# Altium schematic sheet I2C_Step_12V_Ann.SchDoc: Драйвер двигателя
size 594 x 420 mm; ApprovedBy: Рогов; CheckedBy: Капустин; DrawnBy: Нечаева; DocumentNumber: I2C_Step_12V Э3; SheetTotal: 1; Format: A2; DocumentType: Электрическая принципиальная; ImagePath: I2C_Step_12V
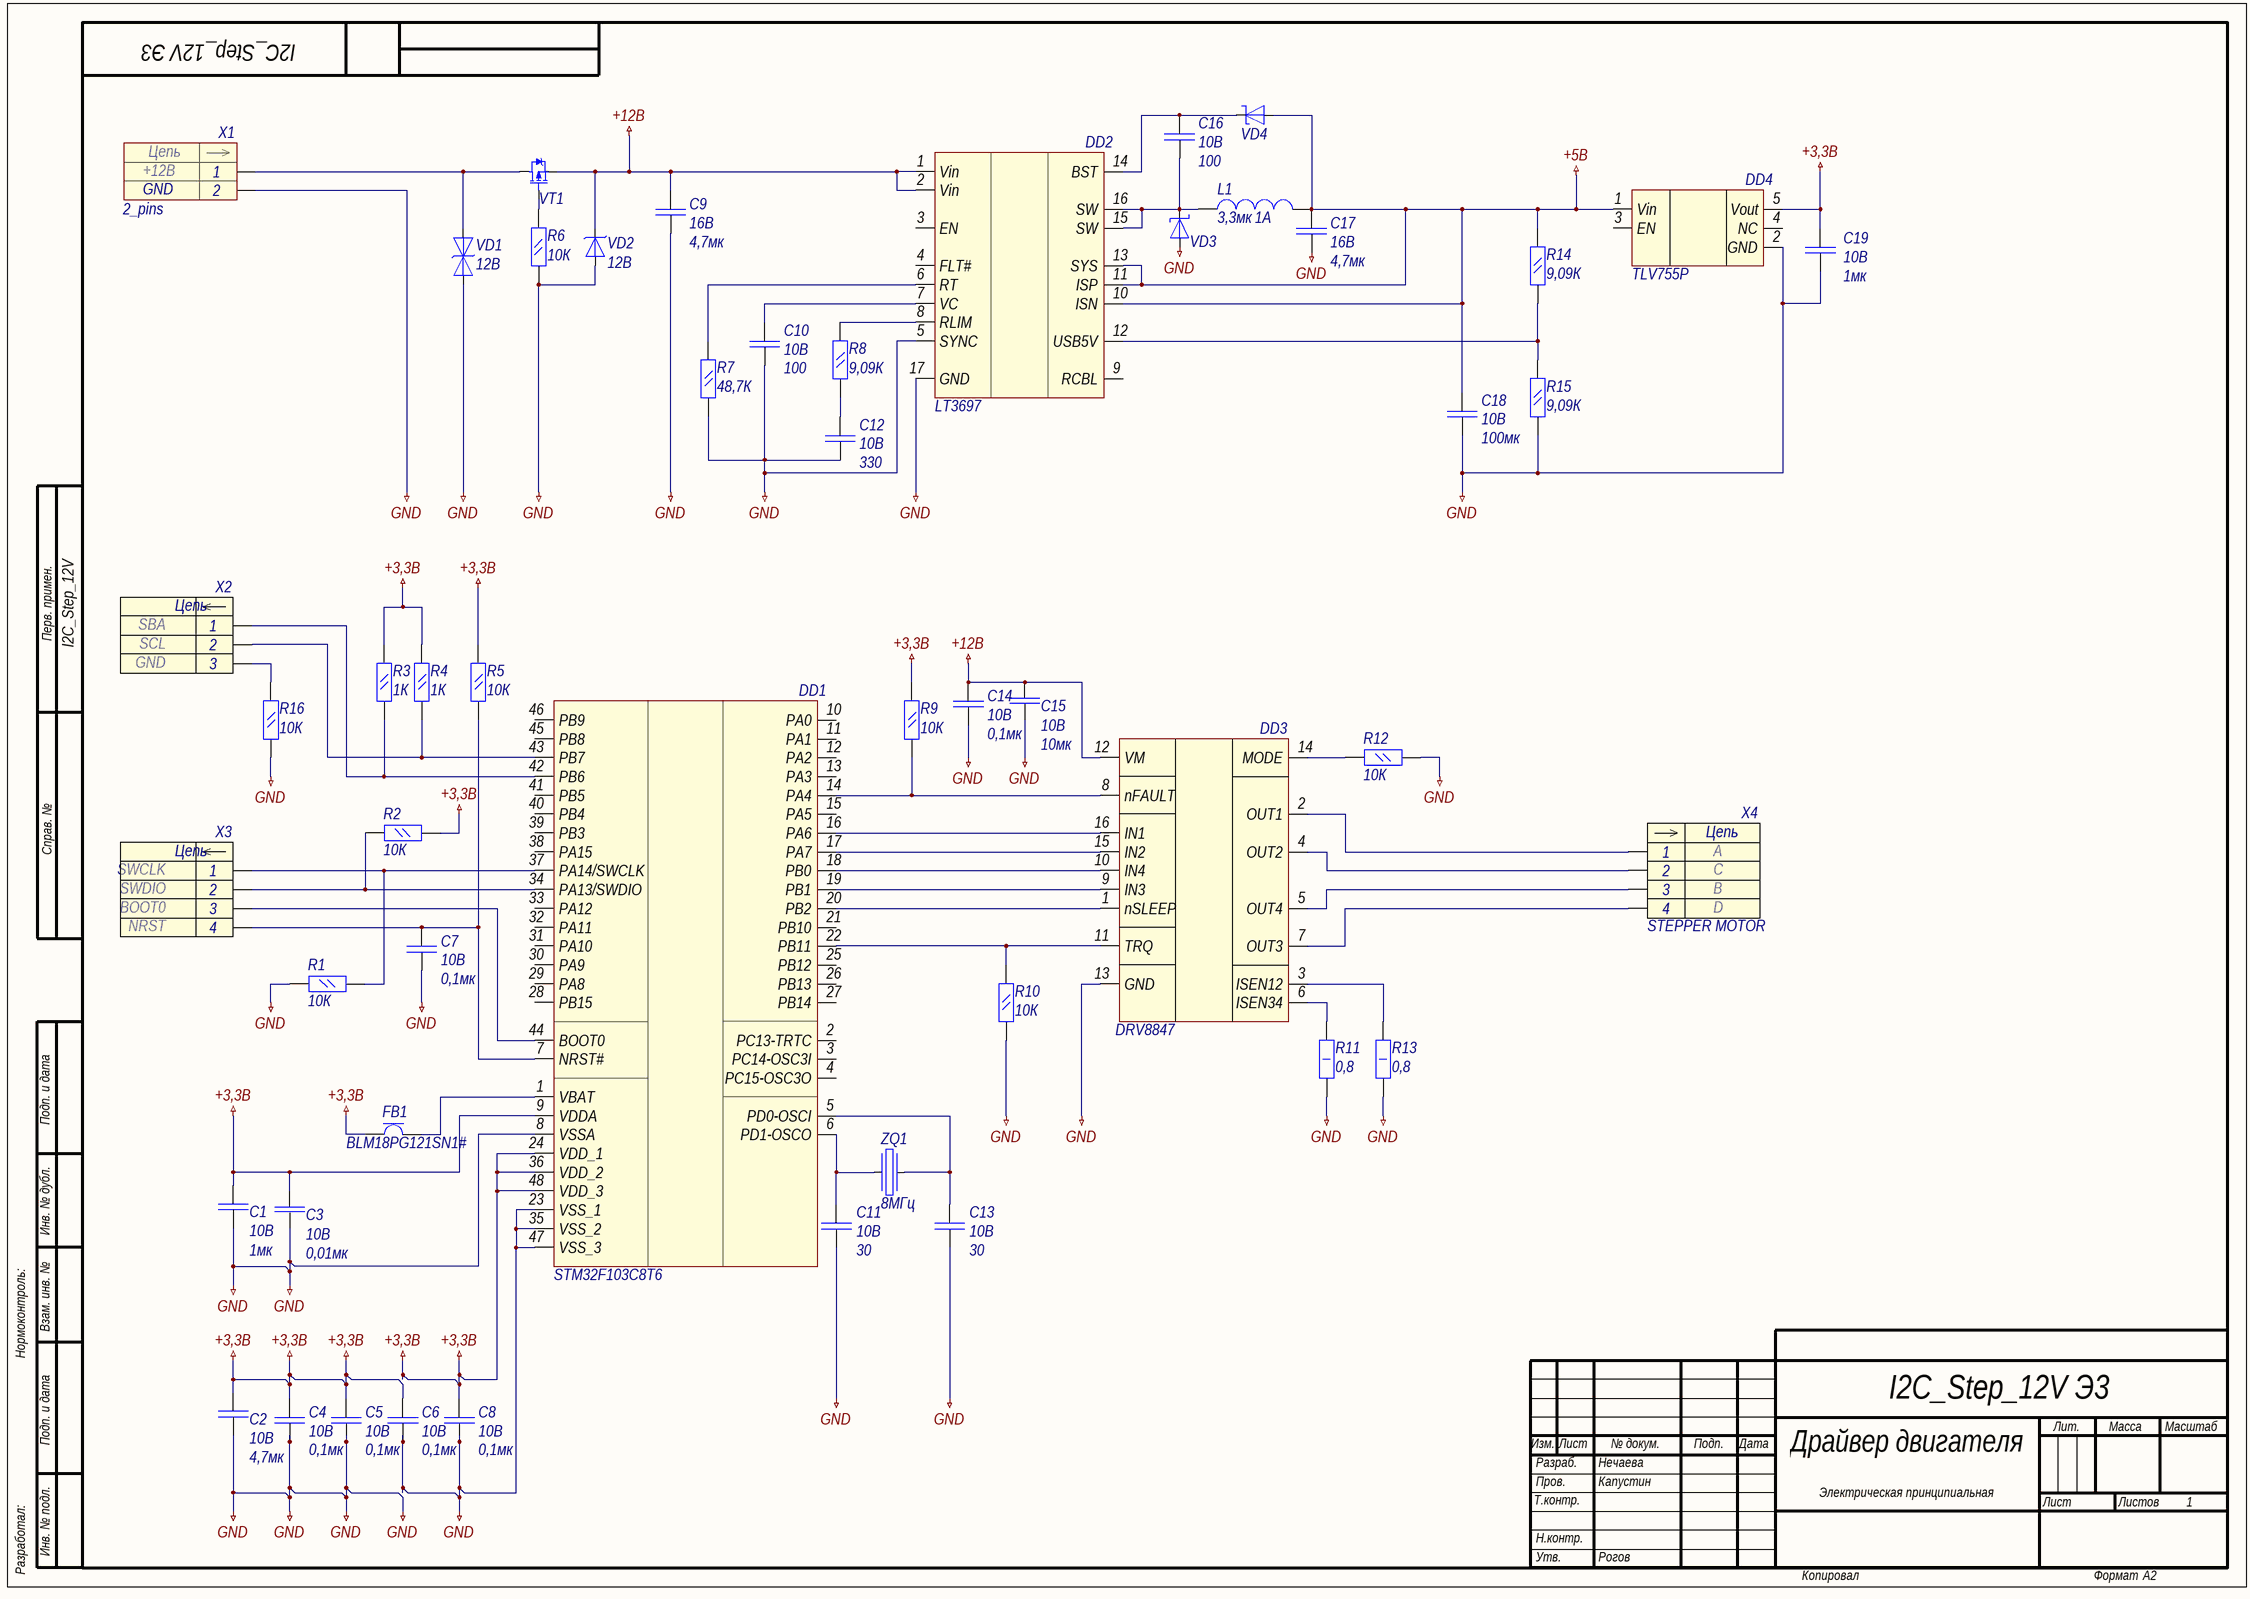
[diagram p0: I2C_Step_12V_Ann.SchDoc]

## Parts
C1  Voltage: 10В  Capacitance: 1мк  [CH0201C]  (hidden comment: Capacitor)
C2  Voltage: 10В  Capacitance: 4,7мк  [CH0402C]  (hidden comment: Capacitor)
C3  Voltage: 10В  Capacitance: 0,01мк  [CH0402C]  (hidden comment: Capacitor)
C4  Voltage: 10В  Capacitance: 0,1мк  [CH0402C]  (hidden comment: Capacitor)
C5  Voltage: 10В  Capacitance: 0,1мк  [CH0402C]  (hidden comment: Capacitor)
C6  Voltage: 10В  Capacitance: 0,1мк  [CH0402C]  (hidden comment: Capacitor)
C7  Voltage: 10В  Capacitance: 0,1мк  [CH0402C]  (hidden comment: Capacitor)
C8  Voltage: 10В  Capacitance: 0,1мк  [CH0402C]  (hidden comment: Capacitor)
C9  Voltage: 16В  Capacitance: 4,7мк  [CH0603C]  (hidden comment: Capacitor)
C10  Voltage: 10В  Capacitance: 100  [CH0201C]  (hidden comment: Capacitor)
C11  Voltage: 10В  Capacitance: 30  [CH0201C]  (hidden comment: Capacitor)
C12  Voltage: 10В  Capacitance: 330  [CH0402C]  (hidden comment: Capacitor)
C13  Voltage: 10В  Capacitance: 30  [CH0201C]  (hidden comment: Capacitor)
C14  Voltage: 10В  Capacitance: 0,1мк  [CH0402C]  (hidden comment: Capacitor)
C15  Voltage: 10В  Capacitance: 10мк  [CH0402C]  (hidden comment: Capacitor)
C16  Voltage: 10В  Capacitance: 100  [CH0201C]  (hidden comment: Capacitor)
C17  Voltage: 16В  Capacitance: 4,7мк  [CH0603C]  (hidden comment: Capacitor)
C18  Voltage: 10В  Capacitance: 100мк  [CH1206C]  (hidden comment: Capacitor)
C19  Voltage: 10В  Capacitance: 1мк  [CH0201C]  (hidden comment: Capacitor)
DD1  STM32F103C8T6  [STM32F103 48pins]
DD2  LT3697  [LT3697]
DD3  DRV8847  [DRV8847]
DD4  TLV755P  [SOT23-5]
FB1  Model: BLM18PG121SN1#  [CH0603L]  (hidden comment: Ferrite bead)
L1  Max current: 1А  Inductance: 3,3мк  [CH0805L]  (hidden comment: *)
R1  Impedance: 10К  [CH0402R]  (hidden comment: Res_0.125)
R2  Impedance: 10К  [CH0402R]  (hidden comment: Res_0.125)
R3  Impedance: 1К  [CH0402R]  (hidden comment: Res_0.125)
R4  Impedance: 1К  [CH0402R]  (hidden comment: Res_0.125)
R5  Impedance: 10К  [CH0402R]  (hidden comment: Res_0.125)
R6  Impedance: 10К  [CH0402R]  (hidden comment: Res_0.125)
R7  Impedance: 48,7К  [CH0805R]  (hidden comment: Res_0.125)
R8  Impedance: 9,09К  [CH0805R]  (hidden comment: Res_0.125)
R9  Impedance: 10К  [CH0402R]  (hidden comment: Res_0.125)
R10  Impedance: 10К  [CH0402R]  (hidden comment: Res_0.125)
R11  Impedance: 0,8  [CH2010R]  (hidden comment: Res_1)
R12  Impedance: 10К  [CH0402R]  (hidden comment: Res_0.125)
R13  Impedance: 0,8  [CH2010R]  (hidden comment: Res_1)
R14  Impedance: 9,09К  [CH0805R]  (hidden comment: Res_0.125)
R15  Impedance: 9,09К  [CH0805R]  (hidden comment: Res_0.125)
R16  Impedance: 10К  [CH0402R]  (hidden comment: Res_0.125)
VD1  Clamping Voltage: 12В  [CH0201L]  (hidden comment: TVS-diod_simmetrical)
VD2  Clamping_Voltage: 12В  [DO214AA]  (hidden comment: TVS-diod_directed)
VD3  Diod Schottky  [DO214AA]  (value not drawn)
VD4  Diod Schottky  [SOT23_132]  (value not drawn)
VT1  *  [SOT23_132]  (value not drawn)
X1  2_pins  Vcc: +12В  [CON: 163-179PH-EX]
X2  2: SCL  3: GND  1: SBA  [CON: PBS-3]  (hidden comment: 3_pins)
X3  2: SWDIO  3: BOOT0  1: SWCLK  4: NRST  [CON: CWF-4R]  (hidden comment: 4_pins)
X4  STEPPER MOTOR  2: C  3: B  1: A  4: D  [CON: CWF-4R]
ZQ1  Freq: 8МГц  [OSC: 5032]  (hidden comment: Oscillator)

## Nets
+3,3В: C1.2(C1-) C2.2(C1-) C3.1(С+) C4.1(C1+) C5.1(C1+) C6.1(C1+) C8.1(C1+) C19.1(C1+) DD1.9(VDDA) DD1.24(VDD_1) DD1.36(VDD_2) DD1.48(VDD_3) DD4.5(Vout) FB1.1 R2.1(C1-) R3.1(C1-) R4.1(C1-) R5.1(C1-) R9.1(C1-)
+5В: C17.1(C1+) C18.1(C1+) DD2.10(ISN) DD2.11(ISP) DD2.13(SYS) DD4.1(Vin) L1.2 R14.1(C1-) VD4.1
+12В: C9.1(C1+) C14.1(C1+) C15.1(С+) DD2.1(Vin) DD2.2(Vin) DD3.12(VM) VD2.2(C) VT1.3(S)
GND: C1.1(C1+) C2.1(C1+) C3.2(С-) C4.2(C1-) C5.2(C1-) C6.2(C1-) C7.2(C1-) C8.2(C1-) C9.2(C1-) C10.2(C1-) C11.2(C1-) C12.2(C1-) C13.2(C1-) C14.2(C1-) C15.2(С-) C17.2(C1-) C18.2(C1-) C19.2(C1-) DD1.8(VSSA) DD1.23(VSS_1) DD1.35(VSS_2) DD1.47(VSS_3) DD2.5(SYNC) DD2.17(GND) DD3.13(GND) DD4.2(GND) R1.2(C1-) R6.1(C1-) R7.2(C1-) R10.2(C1-) R11.1 R12.1(C1-) R13.1 R15.2(C1-) R16.2(C1-) VD1.1(A) VD2.1(A) VD3.1 X1.2
NetC7_1: C7.1(C1+) DD1.7(NRST#) R5.2(C1-) X3.4
NetC10_1: C10.1(C1+) DD2.7(VC)
NetC11_1: C11.1(C1+) DD1.6(PD1-OSCO) ZQ1.1
NetC12_1: C12.1(C1+) R8.2(C1-)
NetC13_1: C13.1(C1+) DD1.5(PD0-OSCI) ZQ1.3
NetC16_1: C16.1(C1+) DD2.14(BST) VD4.2
NetC16_2: C16.2(C1-) DD2.15(SW) DD2.16(SW) L1.1(C1-) VD3.2
NetDD1_1: DD1.1(VBAT) FB1.2
NetDD1_14: DD1.14(PA4) DD3.8(nFAULT) R9.2(C1-)
NetDD1_16: DD1.16(PA6) DD3.16(IN1)
NetDD1_17: DD1.17(PA7) DD3.15(IN2)
NetDD1_18: DD1.18(PB0) DD3.10(IN4)
NetDD1_19: DD1.19(PB1) DD3.9(IN3)
NetDD1_20: DD1.20(PB2) DD3.1(nSLEEP)
NetDD1_22: DD1.22(PB11) DD3.11(TRQ) R10.1(C1-)
NetDD1_34: DD1.34(PA13/SWDIO) R2.2(C1-) X3.2
NetDD1_37: DD1.37(PA14/SWCLK) R1.1(C1-) X3.1
NetDD1_42: DD1.42(PB6) R3.2(C1-) X2.1
NetDD1_43: DD1.43(PB7) R4.2(C1-) X2.2
NetDD1_44: DD1.44(BOOT0) X3.3
NetDD2_6: DD2.6(RT) R7.1(C1-)
NetDD2_8: DD2.8(RLIM) R8.1(C1-)
NetDD2_12: DD2.12(USB5V) R14.2(C1-) R15.1(C1-)
NetDD3_2: DD3.2(OUT1) X4.1
NetDD3_3: DD3.3(ISEN12) R13.2
NetDD3_4: DD3.4(OUT2) X4.2
NetDD3_5: DD3.5(OUT4) X4.3
NetDD3_6: DD3.6(ISEN34) R11.2
NetDD3_7: DD3.7(OUT3) X4.4
NetDD3_14: DD3.14(MODE) R12.2(C1-)
NetR6_2: R6.2(C1-) VT1.1(G)
NetR16_1: R16.1(C1-) X2.3
NetVD1_2: VD1.2(C) VT1.2(D) X1.1

Not connected (* = marked no-connect by the designer): DD1 2(PC13-TRTC) 3(PC14-OSC3I) 4(PC15-OSC3O) 10(PA0) 11(PA1) 12(PA2) 13(PA3) 15(PA5) 21(PB10) 25(PB12) 26(PB13) 27(PB14) 28(PB15) 29(PA8) 30(PA9) 31(PA10) 32(PA11) 33(PA12) 38(PA15) 39(PB3) 40(PB4) 41(PB5) 45(PB8) 46(PB9); DD2 3(EN) 4(FLT#) 9(RCBL); DD4 3(EN) 4(NC)

## Notes on the sheet
- Перв. примен.
- Справ. №
- Подп. и дата
- Инв. № дубл.
- Нормоконтроль:
- Взам. инв. №
- Изм.
- Лист
- № докум.
- Подп.
- Дата
- Лит.
- Масса
- Масштаб
- Т.контр.
- Пров.
- Разраб.
- Листов
- Разработал:
- Инв. № подл.
- Н.контр.
- Утв.
- Копировал
- Формат
- (in symbol 2_pins) Цепь; GND
- (in symbol 3_pins) Цепь
- (in symbol 4_pins) Цепь

## Library data of the parts
C1 C19 = Capacitor: Manufacture: Murata Electronics; Model: GRM033C81A105ME05E; Case: 0201; HelpURL: https://ru.mouser.com/ProductDetail/Murata-Electronics/GRM033C81A105ME05E?qs=sGAEpiMZZMs0AnBnWHyRQN7%2fAA2D2lPPXfhIkJ3ChWM%252bNp28BKy3Ug%3d%3d
C2 = Capacitor: Manufacture: Murata Electronics; Model: ZRB15XR61A475KE01D; Case: 0402; HelpURL: https://ru.mouser.com/ProductDetail/Murata-Electronics/ZRB15XR61A475KE01D?qs=sGAEpiMZZMs0AnBnWHyRQO9VYadaKTO%252beZnE9zFUsbv4FmCibz4ZfQ%3d%3d
C3 = Capacitor: Manufacture: Yageo; Model: CC0402MRX7R6BB103; Case: 0402; HelpURL: https://ru.mouser.com/ProductDetail/Yageo/CC0402MRX7R6BB103?qs=sGAEpiMZZMs0AnBnWHyRQCF1lTWZ1EBLC11KxQK9NtY%3D
C4-C8 C14 = Capacitor: Manufacture: AVX; Model: 0402ZD103KAT2A; Case: 0402; HelpURL: https://ru.mouser.com/ProductDetail/AVX/0402ZD103KAT2A?qs=sGAEpiMZZMs0AnBnWHyRQKdiqyDPVQdAu74W%2fwwRq8A%3d
C9 C17 = Capacitor: Manufacture: Murata Electronics; Model: GRM188R61C475KAAJD; Case: 0603; HelpURL: https://ru.mouser.com/ProductDetail/Murata-Electronics/GRM188R61C475KAAJD?qs=sGAEpiMZZMs0AnBnWHyRQHS%2f3XE0oMwxE3tFP4oDIiY%3d
C10 C16 = Capacitor: Manufacture: KEMET; Model: C0201C101K8GACTU; Case: 0201; HelpURL: https://ru.mouser.com/ProductDetail/KEMET/C0201C101K8GACTU?qs=sGAEpiMZZMs0AnBnWHyRQB5KqWiNAtmEn9gsTWOdKS%252b7RrFbxqtALA%3d%3d
C11 C13 = Capacitor: Manufacture: KEMET; Model: CBR02C308B8GAC; Case: 0201; HelpURL: https://ru.mouser.com/ProductDetail/KEMET/CBR02C308B8GAC?qs=sGAEpiMZZMs0AnBnWHyRQKJCfzG%2fi9wHnix1yOwfSPhOUzhoHh%252bTpQ%3d%3d
C12 = Capacitor: Manufacture: Vishay / Vitramon; Model: VJ0402Y331MXQCW1BC; Case: 0402; HelpURL: https://ru.mouser.com/ProductDetail/Vishay-Vitramon/VJ0402Y331MXQCW1BC?qs=sGAEpiMZZMs0AnBnWHyRQHefeAIkSpb%2fKjIwGvKZvs8%3d
C15 = Capacitor: Manufacture: Yageo; Model: CC0402MRX5R6BB106; Case: 0402; HelpURL: https://ru.mouser.com/ProductDetail/Yageo/CC0402MRX5R6BB106?qs=sGAEpiMZZMsh%252B1woXyUXj67dvM3QAimZTx2LImfM178%3D
C18 = Capacitor: Manufacture: TDK; Model: C3216X5R1A107M160AC; Case: 1206; HelpURL: https://ru.mouser.com/ProductDetail/TDK/C3216X5R1A107M160AC?qs=sGAEpiMZZMs0AnBnWHyRQEWjzA2rN6H9eWVfGykJv7Q%3d
DD1 = STM32: Manufacture: STMicroelectronics; Case: LQFP48; Model: STM32F103C8T6; HelpURL: https://www.st.com/en/microcontrollers-microprocessors/stm32f103c8.html
DD2 = LT3697: 6~18 to 5; Manufacture: Analog Devices; Model: LT3697; HelpURL: https://www.analog.com/en/products/lt3697.html; Case: *
DD3 = DRV8847: Manufacture: Texas Instruments; HelpURL: http://www.ti.com/product/DRV8847; Case: TSSOP; Model: DRV8847
DD4 = LDO +3.3V: Manufacture: Texas Instruments; Case: SOT-23; HelpUrL: http://www.ti.com/product/TLV755P?keyMatch=TLV755P&tisearch=Search-EN-Everything; Model: TLV755P
FB1 = Ferrite bead: Manufacture: murata; Max current: 2A; Impedance: 120; Case: 0603; HelpURL: https://www.murata.com/en-us/products/productdetail?partno=BLM18PG121SN1%23; Inductance: *
L1 = Inductor: Manufacture: Murata Electronics; Model: LQM21PZ3R3MGRD; Impedance: 150м; HelpURL: https://ru.mouser.com/ProductDetail/Murata-Electronics/LQM21PZ3R3MGRD?qs=sGAEpiMZZMsg%252by3WlYCkU2iuTbKTbm6Zxs6Ix4GkUPA%3d; Case: 0805
R1 R2 R5 R6 R9 R10 R12 R16 = Res_0.125: Manufacture: Yageo; Model: AC0402FR-7W10KL; Case: 0402; HelpURL: https://ru.mouser.com/ProductDetail/Yageo/AC0402FR-7W10KL?qs=sGAEpiMZZMvdGkrng054txbN%2f5LBcxld3gyqgmBuiXRPLjwmdNqO3A%3d%3d
R3 R4 = Res_0.125: Manufacture: KOA Speer; Model: SG73P1ETTP1001F; Case: 0402; HelpURL: https://ru.mouser.com/ProductDetail/KOA-Speer/SG73P1ETTP1001F?qs=sGAEpiMZZMvdGkrng054t%2f16WM9J8YovCYtiWkW5%2faA%3d
R7 = Res_0.125: Manufacture: Panasonic Industrial Devices; Model: ERJ-6ENF4872V; Case: 0805; HelpURL: https://ru.mouser.com/ProductDetail/Panasonic-Industrial-Devices/ERJ-6ENF4872V?qs=sGAEpiMZZMvdGkrng054tx7%2f6%252bNA3LAJLLBsBMFOrm0%3d
R8 R14 R15 = Res_0.125: Manufacture: Panasonic Industrial Devices; Model: ERJ-6ENF9091V; Case: 0805; HelpURL: https://ru.mouser.com/ProductDetail/Panasonic-Industrial-Devices/ERJ-6ENF9091V?qs=sGAEpiMZZMvdGkrng054tx7%2f6%252bNA3LAJZkxjwUnWjWM%3d
R11 R13 = Res_1: Manufacture: Vishay Dale; Model: CRCW20101K69FKEF; Power: 1Вт; Case: 2010; HelpURL: https://www.digikey.com/product-detail/en/CRCW20101K69FKEF/541-1.69KACCT-ND/1179159?WT.z_cid=ref_netcomponents_dkc_buynow&utm_source=netcomponents&utm_medium=aggregator&utm_campaign=buynow
VD1 = TVS-diod_simmetrical: Manufacturer: Littelfuse; Model: SP3022-01WTG; HelpURL: https://ru.mouser.com/ProductDetail/Littelfuse/SP3022-01WTG?qs=sGAEpiMZZMsItbzKdwyIez7NGmqnzL8h47KYC2e%252bM%2f4NVETz1A7KGA%3d%3d; Case: 0201
VD2 = TVS-diod_directed: Manufacturer: Bourns; Model: CD214B-T7.0ALF; HelpURL: https://ru.mouser.com/ProductDetail/Bourns/CD214B-T70ALF?qs=sGAEpiMZZMsItbzKdwyIexL102H4jKkFOiaKL2EcEgo%3d; Ipp: *; Case: DO-214AA-2
VD3 = Diod Schottky: Manufacturer: Rectron; Model: FM5822B-W; If: 3А; Vrrm: 40В; ComponentKind: *; HelpURL: https://ru.mouser.com/ProductDetail/Rectron/FM5822B-W?qs=sGAEpiMZZMtQ8nqTKtFS%2fGuc2LbLh1yNV0sywe9%2fy3k%3d
VD4 = Diod Schottky: Manufacturer: Toshiba; Model: 1SS374(TE85L,F); If: 200мА; Vrrm: 15В; ComponentKind: *; HelpURL: https://ru.mouser.com/ProductDetail/Toshiba/1SS374TE85LF?qs=sGAEpiMZZMtQ8nqTKtFS%2fOl9H8JU2QXlyYvmz0vcRmull8rlMQPxpQ%3d%3d
VT1 = P-Channel: Manufacture: Diodes Incorporated; Id: 2,4А; Model: DMG2301LK-7; Vgs: 300мВ; Vsd: 20В; HelpURL: https://ru.mouser.com/ProductDetail/Diodes-Incorporated/DMG2301LK-7?qs=sGAEpiMZZMshyDBzk1%2fWi3VK%2fMVeCy7TGgocA8mg7FfG8rajAhy0Kw%3d%3d
X2 = 3_pins: Manufacture: Omron Electronics; Model: XN2D-1371; HelpURL: https://ru.mouser.com/ProductDetail/Omron-Electronics/XN2D-1371?qs=sGAEpiMZZMvd2mIcYG7oaC0TeQEBnk0J8ExArlTDElw%3D; Case: *
X3 = 4_pins: Manufacture: Omron Electronics; Model: XN2D-4471; HelpURL: https://ru.mouser.com/ProductDetail/Omron-Electronics/XN2D-4471?qs=sGAEpiMZZMvd2mIcYG7oaC0TeQEBnk0JvHtcE4UuDS0%3D; Case: *
X4 = 4_pins: Bipolar Stepper Motor 200 Step 0.35A 12VDC; Manufacture: stepperonline; ManufactureConnector: Omron Electronics; Model: 8HS11-0204S; ModelConnector: XN2D-4471; HelpURL: https://www.omc-stepperonline.com/nema-8-stepper-motor/nema-8-bipolar-18deg-16ncm-23ozin-02a-48v-20x20x28mm-4-wires-8hs11-0204s.html; Case: 20x20x28mm; CaseConnector: *; HelpURLConnector: https://ru.mouser.com/ProductDetail/Omron-Electronics/XN2D-4471?qs=sGAEpiMZZMvd2mIcYG7oaC0TeQEBnk0JvHtcE4UuDS0%3D
ZQ1 = Oscillator: Manufacture: CTS Electronic Components; Model: 636L3C008M00000; HelpURL: https://ru.mouser.com/ProductDetail/CTS-Electronic-Components/636L3C008M00000?qs=sGAEpiMZZMt8zWNA7msRCjl4WCD9T6KEFNudNQm%252BeAU%3D; Case: 5x3,2mm
X1 = 2_pins: HelpURL: https://ru.farnell.com/gct-global-connector-technology/dcj250-10-a-k1-k/dc-power-jack-5a-20vdc-black/dp/2524130?st=power%20jack